# EAGLE schematic OPNpool r2 (EAGLE 9.6.2)
REV: 0.1
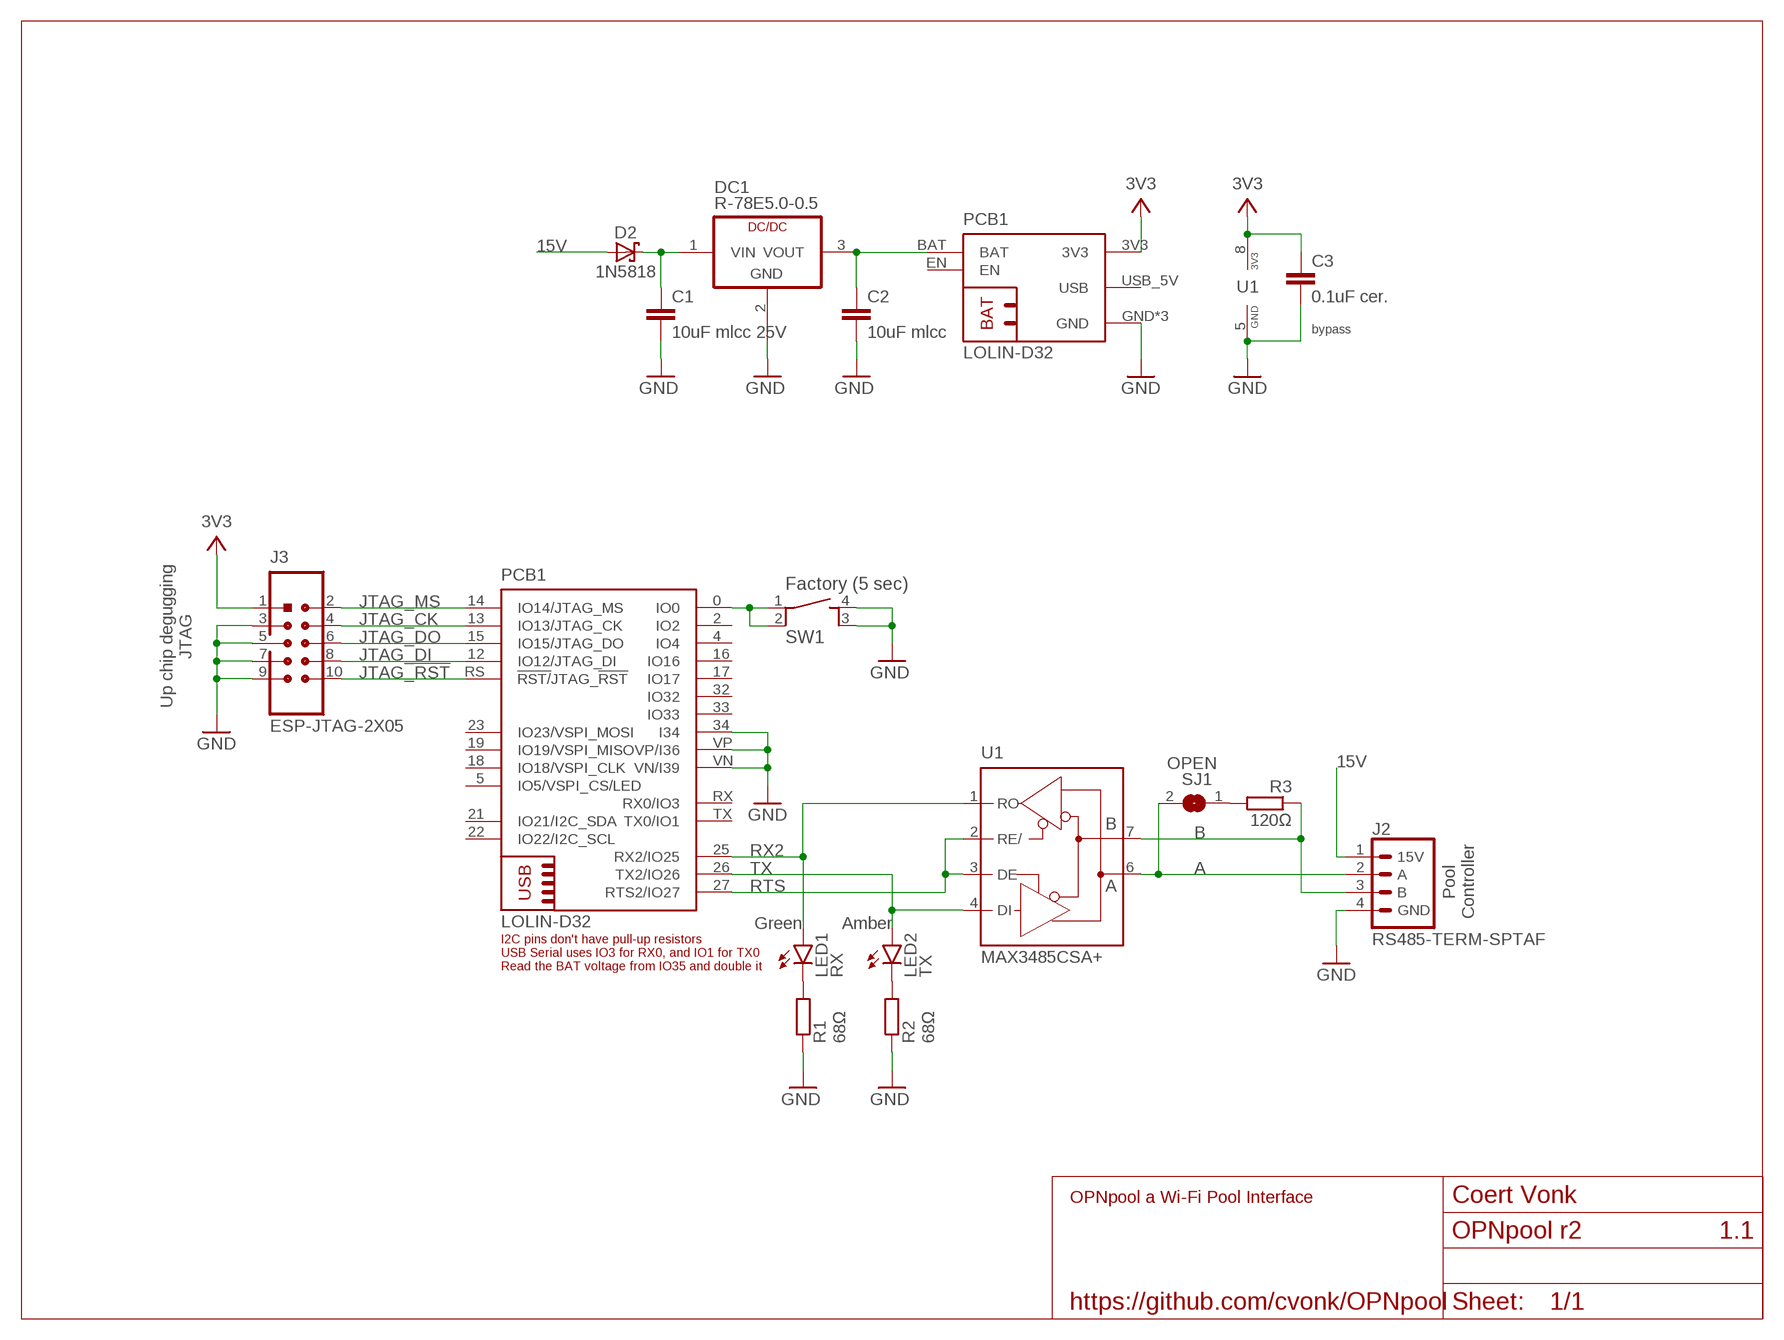
[diagram p0: schematic, sheet 1]
U$1 (FRAME_LETTER_L): AUTHOR_NAME: Coert Vonk; DESCRIPTION: OPNpool a Wi-Fi Pool Interface; REV: 1.1; URL: https://github.com/cvonk/OPNpool

## Parts
C1  10uF mlcc 25V  C-EUC0805K  [C0805K]
C2  10uF mlcc  C-EUC0805K  [C0805K]
C3  0.1uF cer.  C-EUC0805K  [C0805K]
D2  1N5818  [DO41-7.6]
DC1  R-78E5.0-0.5  [SIP3]
J2  RS485-TERM-SPTAF  [SPTAF1/4-5,0-LL]
J3  ESP-JTAG-2X05  [2X05_SHROUDED]
LED1  RX  LEDCHIPLED_0805  [CHIPLED_0805]
LED2  TX  LEDCHIPLED_0805  [CHIPLED_0805]
PCB1  LOLIN-D32  [LOLIN-D32]
R1  68Ω  R-EU_R0805  [R0805]
R2  68Ω  R-EU_R0805  [R0805]
R3  120Ω  R-EU_R0805  [R0805]
SJ1  OPEN  SJ  [SJ]
SW1  Factory (5 sec)  1-1825910-4  [TE_1-1825910-4]
U1  MAX3485CSA+  [SO08]

## Nets
3V3: C3.1 J3.1(3V3) PCB1.3V3(P:3V3) U1.8(P:VCC)
15V: D2.A J2.1(15V)
A: J2.2(A) SJ1.2 U1.6(A)
B: J2.3(B) R3.1 U1.7(B)
GND: C1.2 C2.2 C3.2 DC1.2(GND) J2.4(GND) J3.3(GND) J3.5(GND) J3.7(GND) J3.9(GND) PCB1.34(I34) PCB1.GND(P:GND) PCB1.GND@1(P:GND) PCB1.GND@2(P:GND) PCB1.VN(VN/I39) PCB1.VP(VP/I36) R1.1 R2.1 SW1.3 SW1.4 U1.5(P:GND)
JTAG_!RST: J3.10(NC) PCB1.RS(!RST/!JTAG_!RST)
JTAG_CK: J3.4(TCK) PCB1.13(IO13/JTAG_CK)
JTAG_DI: J3.8(TDI) PCB1.12(IO12/JTAG_DI)
JTAG_DO: J3.6(TDO) PCB1.15(IO15/JTAG_DO)
JTAG_MS: J3.2(TMS) PCB1.14(IO14/JTAG_MS)
N$1: LED1.C R1.2
N$2: LED2.C R2.2
N$3: PCB1.0(IO0) SW1.1 SW1.2
N$5: R3.2 SJ1.1
RTS: PCB1.27(RTS2/IO27) U1.2(RE/) U1.3(DE)
RX2: LED1.A PCB1.25(RX2/IO25) U1.1(RO)
TX: LED2.A PCB1.26(TX2/IO26) U1.4(DI)
VIN: C1.1 D2.C DC1.1(VIN)
VOUT: C2.1 DC1.3(VOUT) PCB1.BAT(P:BAT)
Unconnected: PCB1.2(IO2) PCB1.4(IO4) PCB1.5(IO5/VSPI_CS/LED) PCB1.16(IO16) PCB1.17(IO17) PCB1.18(IO18/VSPI_CLK) PCB1.19(IO19/VSPI_MISO) PCB1.21(IO21/I2C_SDA) PCB1.22(IO22/I2C_SCL) PCB1.23(IO23/VSPI_MOSI) PCB1.32(IO32) PCB1.33(IO33) PCB1.EN(P:EN) PCB1.RX(RX0/IO3) PCB1.TX(TX0/IO1) PCB1.USB_5V(P:USB)

## Notes on the sheet
- bypass
- Up chip degugging
  JTAG
- Pool
  Controller
- Green | Amber

## Library data of the parts
C1 C2 = rcl:C-EU: CAPACITOR, European symbol; MANF: Murata Electronics; MANF#: GJ821BR61E106KE11L; MOUSER#: 81-GJ821BR61E106KE1L; SPICEPREFIX: C
C3 = rcl:C-EU: CAPACITOR, European symbol; MANF: KEMET; MANF#: C0805C104K1RECAUTO; MOUSER#: 80-C0805C104K1REAUTO; SPICEPREFIX: C
D2 = Coert Vonk:1N581*: 1.0A SCHOTTKY BARRIER RECTIFIER Source: http://www.diodes.com/datasheets/ds23001.pdf; MANF: Rectron; MANF#: 1N5818-T; MOUSER#: 583-1N5818-T
DC1 = Coert Vonk:R-78E*-0.5: DC/DC-Converter 5V 500 mA Technical specifications: Manufacturer: Recom Input Voltage: 7 - 28 V Output Voltage: 5 V Output Current: 500 mA Mfr.: R-78E5.0-0.5, data sheet <http://www.recom-power.com/pdf/Innoline/R-78Exx-0.5.pdf> Mouser: 919-R-78E5.0-0.5, abt. $2.70; MANF: RECOM Power; MANF#: R-78E5.0-0.5; MOUSER#: 919-R-78E5.0-0.5
J2 = Coert Vonk:RS485-TERM: SPTAF 1/ 4-5,0-LL - 1864451, PCB push terminal block Technical specifications: Manufacturer: Phoenix Contact Current Rating: 13.5 A Voltage Rating: 320 V Wire Gauge Range: 24 AWG to 18 AWG Mfr.#: 1864451 Mouser: 651-1864451, abt. $1.85; MANF: Phoenix Contact; MANF#: 1864451; MOUSER#: 651-1864451
J3 = Coert Vonk:ESP-JTAG: 10-pin JTAG Header, shrouded header, 2-row, 2.54 pitch Specifications: Manufacturer: Molex Voltage rating: 250 VDC Current rating: 2.5 A Operating temperature: -55 - 120 C Mfr.#: 70246-1004 Mouser #: 538-70246-1004, about $1.19, data sheet <https://www.mouser.com/datasheet/2/276/0702461004_PCB_HEADERS-229930.pdf>; DIGIKEY#: WM3478-ND; MANF: Molex; MANF#: 70246-1004; MOUSER#: 538-70246-1004
LED1 LED2 = OPNpool:LED: LED OSRAM: - CHIPLED LG R971, LG N971, LY N971, LG Q971, LY Q971, LO R971, LY R971 LH N974, LH R974 LS Q976, LO Q976, LY Q976 LO Q996 - Hyper CHIPLED LW Q18S LB Q993, LB Q99A, LB R99A - SideLED LS A670, LO A670, LY A670, LG A670, LP A670 LB A673, LV A673, LT A673, LW A673 LH A674 LY A675 LS A676, LA A676, LO A676, LY A676, LW A676 LS A679, LY A679, LG A679 - Hyper Micro SIDELED® LS Y876, LA Y876, LO Y876, LY Y876 LT Y87S - SmartLED LW L88C, LW L88S LB L89C, LB L89S, LG L890 LS L89K, LO L89K, LY L89K LS L896, LA L896, LO L896, LY L896 - TOPLED LS T670, LO T670, LY T670, LG T670, LP T670 LSG T670, LSP T670, LSY T670, LOP T670, LYG T670 LG T671, LOG T671, LSG T671 LB T673, LV T673, LT T673, LW T673 LH T674 LS T676, LA T676, LO T676, LY T676, LB T676, LH T676, LSB T676, LW T676 LB T67C, LV T67C, LT T67C, LS T67K, LO T67K, LY T67K, LW E67C LS E67B, LA E67B, LO E67B, LY E67B, LB E67C, LV E67C, LT E67C LW T67C LS T679, LY T679, LG T679 LS T770, LO T770, LY T770, LG T770, LP T770 LB T773, LV T773, LT T773, LW T773 LH T774 LS E675, LA E675, LY E675, LS T675 LS T776, LA T776, LO T776, LY T776, LB T776 LHGB T686 LT T68C, LB T68C - Hyper Mini TOPLED® LB M676 - Mini TOPLED Santana® LG M470 LS M47K, LO M47K, LY M47K Source: http://www.osram.convergy.de LUXEON: - LUMILED® LXK2-PW12-R00, LXK2-PW12-S00, LXK2-PW14-U00, LXK2-PW14-V00 LXK2-PM12-R00, LXK2-PM12-S00, LXK2-PM14-U00 LXK2-PE12-Q00, LXK2-PE12-R00, LXK2-PE12-S00, LXK2-PE14-T00, LXK2-PE14-U00 LXK2-PB12-K00, LXK2-PB12-L00, LXK2-PB12-M00, LXK2-PB14-N00, LXK2-PB14-P00, LXK2-PB14-Q00 LXK2-PR12-L00, LXK2-PR12-M00, LXK2-PR14-Q00, LXK2-PR14-R00 LXK2-PD12-Q00, LXK2-PD12-R00, LXK2-PD12-S00 LXK2-PH12-R00, LXK2-PH12-S00 LXK2-PL12-P00, LXK2-PL12-Q00, LXK2-PL12-R00 Source: www.luxeon.com KINGBRIGHT: KA-3528ASYC Source: www.kingbright.com
PCB1 = Coert Vonk:LOLIN-D32: Wemos LOLIN D32, ESP-WROOM-32 Technical specifications: Manufacturer: Wemos SoC: ESP32-WROOM-32, 4 MByte flash, max 240MHz Optional battery: 3.7V Lipo, connector PH-2(2.0mm) UART: CH340, micro-USB connector Mfr.#: LOLIN D32, data sheet <https://wiki.wemos.cc/products:d32:d32> Alibaba: 32808551116, about $6.50; ALIEXPRESS#: 32808551116; MANF: WEMOS Electronics; MANF#: D32
R1-R3 = rcl:R-EU_: RESISTOR, European symbol; MANF: Bourns; MANF#: CRM0805-JW-1R5ELF; MOUSER#: 652-CRM0805JW1R5ELF; SPICEPREFIX: R
SJ1 = jumper:SJ: SMD solder JUMPER
SW1 = 1-1825910-4:1-1825910-4: Switch Tactile OFF (ON) SPST Round Button PC Pins 0.05A 24VDC 100000Cycles 1.56N Thru-Hole Loose; COMMENT: 1-1825910-4; DESCRIPTION: Switch Tactile OFF (ON) SPST Round Button PC Pins 0.05A 24VDC 100000Cycles 1.56N Thru-Hole; DIGI-KEY_PART_NUMBER: 450-1653-ND; MF: TE Connectivity; MP: 1-1825910-4; PACKAGE: None; PURCHASE-URL: https://pricing.snapeda.com/search/part/1-1825910-4/?ref=eda
U1 = Coert Vonk:MAX3485CSA+: RS-485 Transceiver 3.3V SMD Technical specifications: Manufacturer: Maxim Integrated Operating supply: 3.3 V, 1.1 mA Output: 3 V, 20 mA Data rate: 10 Mb/s Temperature range: 0 - 70 C Mfr.: R-78E5.0-0.5 Mouser: 919-R-78E5.0-0.5, abt. $2.70, details <https://www.mouser.com/ProductDetail/Maxim-Integrated/MAX3485CSA%2b>; MANF: Maxim Integrated; MANF#: MAX3485CSA+; MF: MAXIM; MOUSER#: 700-MAX3485CSA; MPN: MAX481CSA; OC_FARNELL: unknown; OC_NEWARK: 90C3817